# EAGLE design BearJR (EAGLE 6.6.0)
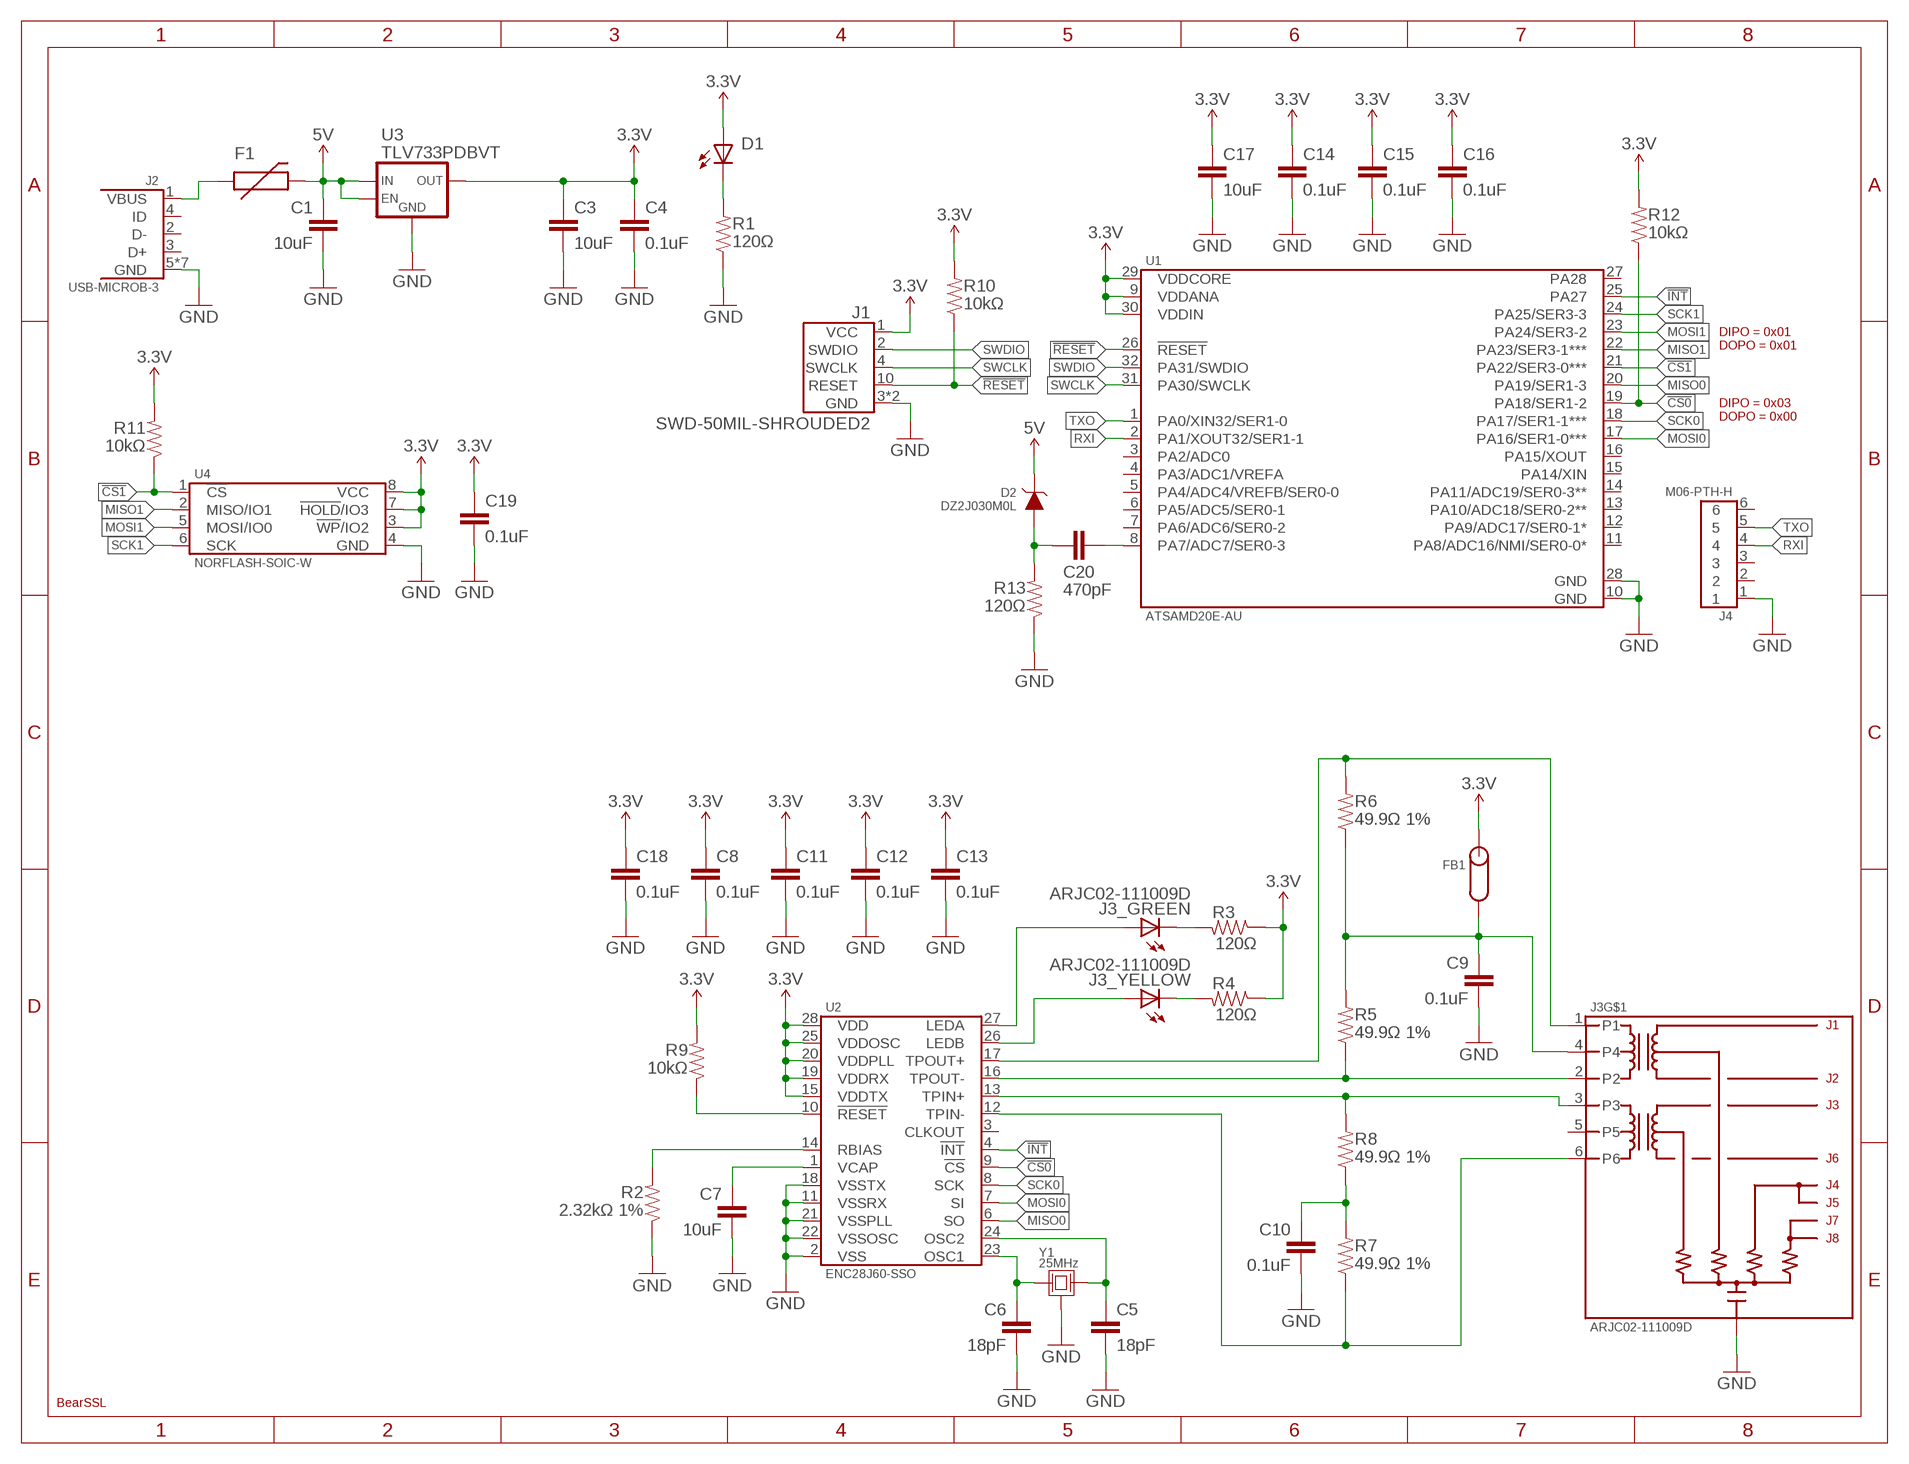
[diagram p0: schematic, sheet 1]

## Parts
C1  10uF  CAP-0603  [0603-CAP]
C3  10uF  CAP-0603  [0603-CAP]
C4  0.1uF  CAP-0603  [0603-CAP]
C5  18pF  CAP-0603  [0603-CAP]
C6  18pF  CAP-0603  [0603-CAP]
C7  10uF  CAP-0603  [0603-CAP]
C8  0.1uF  CAP-0603  [0603-CAP]
C9  0.1uF  CAP-0603  [0603-CAP]
C10  0.1uF  CAP-0603  [0603-CAP]
C11  0.1uF  CAP-0603  [0603-CAP]
C12  0.1uF  CAP-0603  [0603-CAP]
C13  0.1uF  CAP-0603  [0603-CAP]
C14  0.1uF  CAP-0603  [0603-CAP]
C15  0.1uF  CAP-0603  [0603-CAP]
C16  0.1uF  CAP-0603  [0603-CAP]
C17  10uF  CAP-0603  [0603-CAP]
C18  0.1uF  CAP-0603  [0603-CAP]
C19  0.1uF  CAP-0603  [0603-CAP]
C20  470pF  CAP-0603  [0603-CAP]
D1  LED-0603  [0603-LED]
D2  DZ2J030M0L  ZENER-SC90  [SC-90]
F1  PTC-1206  [1206-PTC]
FB1  FERRITE-0805  [0805]
J1  SWD-50MIL-SHROUDED2  [M05X2-50MIL-SHROUD]
J2  USB-MICROB-3  [10118192-0001LF]
J3  ARJC02-111009D  [ETHERNET]
J4  M06-PTH-H  [M06-PTH-H]
R1  120Ω  RESISTOR-0603  [0603-CAP]
R2  2.32kΩ 1%  RESISTOR-0603  [0603-CAP]
R3  120Ω  RESISTOR-0603  [0603-CAP]
R4  120Ω  RESISTOR-0603  [0603-CAP]
R5  49.9Ω 1%  RESISTOR-0805  [0805-RES]
R6  49.9Ω 1%  RESISTOR-0805  [0805-RES]
R7  49.9Ω 1%  RESISTOR-0805  [0805-RES]
R8  49.9Ω 1%  RESISTOR-0805  [0805-RES]
R9  10kΩ  RESISTOR-0603  [0603-CAP]
R10  10kΩ  RESISTOR-0603  [0603-CAP]
R11  10kΩ  RESISTOR-0603  [0603-CAP]
R12  10kΩ  RESISTOR-0603  [0603-CAP]
R13  120Ω  RESISTOR-0603  [0603-CAP]
U1  ATSAMD20E-AU  [TQFP-32]
U2  ENC28J60-SSO  [SSOP-28]
U3  TLV733PDBVT  [SOT-23-5]
U4  NORFLASH-SOIC-W  [SOIC-8-W]
U$1  BEAR_SSL  [BEAR_SSL]
Y1  25MHz  CRYSTAL-3.2X2.5  [FA-238]

## Nets
3.3V: C3.1 C4.1 C8.1 C11.1 C12.1 C13.1 C14.1 C15.1 C16.1 C17.1 C18.1 C19.1 D1.A FB1.2 J1.1(VCC) R3.1 R4.1 R9.2 R10.2 R11.2 R12.2 U1.9(VDDANA) U1.29(VDDCORE) U1.30(VDDIN) U2.15(VDDTX) U2.19(VDDRX) U2.20(VDDPLL) U2.25(VDDOSC) U2.28(VDD) U3.5(OUT) U4.3(!WP!/IO2) U4.7(!HOLD!/IO3) U4.8(VCC)
5V: C1.1 D2.C F1.P$2 U3.1(IN) U3.3(EN)
!CS0: R12.1 U1.19(PA18/SER1-2) U2.9(!CS)
!CS1: R11.1 U1.21(PA22/SER3-0***) U4.1(!CS)
!INT: U1.25(PA27) U2.4(!INT)
!RESET: J1.10(RESET) R10.1 U1.26(!RESET)
CT: C9.1 FB1.1 J3.4 R5.2 R6.1
GND: C1.2 C3.2 C4.2 C5.2 C6.2 C7.2 C8.2 C9.2 C10.2 C11.2 C12.2 C13.2 C14.2 C15.2 C16.2 C17.2 C18.2 C19.2 J1.3(GND) J1.5(GND) J2.5(GND) J2.P$6(GND) J2.P$7(GND) J2.P$8(GND) J2.P$9(GND) J2.P$10(GND) J2.P$11(GND) J3.8 J3.P$5(P8) J3.P$6(P8) J4.1 R1.1 R2.1 R13.1 U1.10(GND) U1.28(GND) U2.2(VSS) U2.11(VSSRX) U2.18(VSSTX) U2.21(VSSPLL) U2.22(VSSOSC) U3.2(GND) U4.4(GND) Y1.2(GND) Y1.4(GND)
MISO0: U1.20(PA19/SER1-3) U2.6(SO)
MISO1: U1.22(PA23/SER3-1***) U4.2(MISO/IO1)
MOSI0: U1.17(PA16/SER1-0***) U2.7(SI)
MOSI1: U1.23(PA24/SER3-2) U4.5(MOSI/IO0)
N$1: F1.P$1 J2.1(VBUS)
N$2: R2.2 U2.14(RBIAS)
N$3: C7.1 U2.1(VCAP)
N$5: D1.C R1.2
N$6: C6.1 U2.23(OSC1) Y1.1
N$7: C5.1 U2.24(OSC2) Y1.3
N$8: R9.1 U2.10(!RESET)
N$9: J3.9(_GREEN:A) U2.27(LEDA)
N$10: J3.11(_YELLOW:A) U2.26(LEDB)
N$11: J3.10(_GREEN:C) R3.2
N$12: J3.12(_YELLOW:C) R4.2
N$13: C20.1 D2.A R13.2
N$14: C20.2 U1.8(PA7/ADC7/SER0-3)
N$17: C10.1 R7.2 R8.1
RXI: J4.4 U1.2(PA1/XOUT32/SER1-1)
SCK0: U1.18(PA17/SER1-1***) U2.8(SCK)
SCK1: U1.24(PA25/SER3-3) U4.6(SCK)
SWCLK: J1.4(SWCLK) U1.31(PA30/SWCLK)
SWDIO: J1.2(SWDIO) U1.32(PA31/SWDIO)
TPIN_N: J3.6 R7.1 U2.12(TPIN-)
TPIN_P: J3.3 R8.2 U2.13(TPIN+)
TPOUT_N: J3.2 R5.1 U2.16(TPOUT-)
TPOUT_P: J3.1 R6.2 U2.17(TPOUT+)
TXO: J4.5 U1.1(PA0/XIN32/SER1-0)
Unconnected: J2.2(D-) J2.3(D+) J2.4(ID) J3.5 J4.2 J4.3 J4.6 U1.3(PA2/ADC0) U1.4(PA3/ADC1/VREFA) U1.5(PA4/ADC4/VREFB/SER0-0) U1.6(PA5/ADC5/SER0-1) U1.7(PA6/ADC6/SER0-2) U1.11(PA8/ADC16/NMI/SER0-0*) U1.12(PA9/ADC17/SER0-1*) U1.13(PA10/ADC18/SER0-2**) U1.14(PA11/ADC19/SER0-3**) U1.15(PA14/XIN) U1.16(PA15/XOUT) U1.27(PA28) U2.3(CLKOUT)

## Notes on the sheet
- DIPO = 0x01
  DOPO = 0x01
- DIPO = 0x03
  DOPO = 0x00

## Library data of the parts
C1 C3-C20 = Passives:CAP
D1 = Passives:LED
D2 = Passives:ZENER
F1 = Passives:PTC
FB1 = Passives:FERRITE
J1 = Connectors:SWD
J2 = Connectors:USB-MICROB
J3 = Connectors:ARJC02-111009D
J4 = Connectors:M06
R1-R13 = Passives:RESISTOR
U1 = Atmel:ATSAMD20E
U2 = Microchip:ENC28J60
U3 = TI:TLV733P
U4 = Passives:NORFLASH
U$1 = Passives:BEAR_SSL
Y1 = Passives:CRYSTAL

## Board
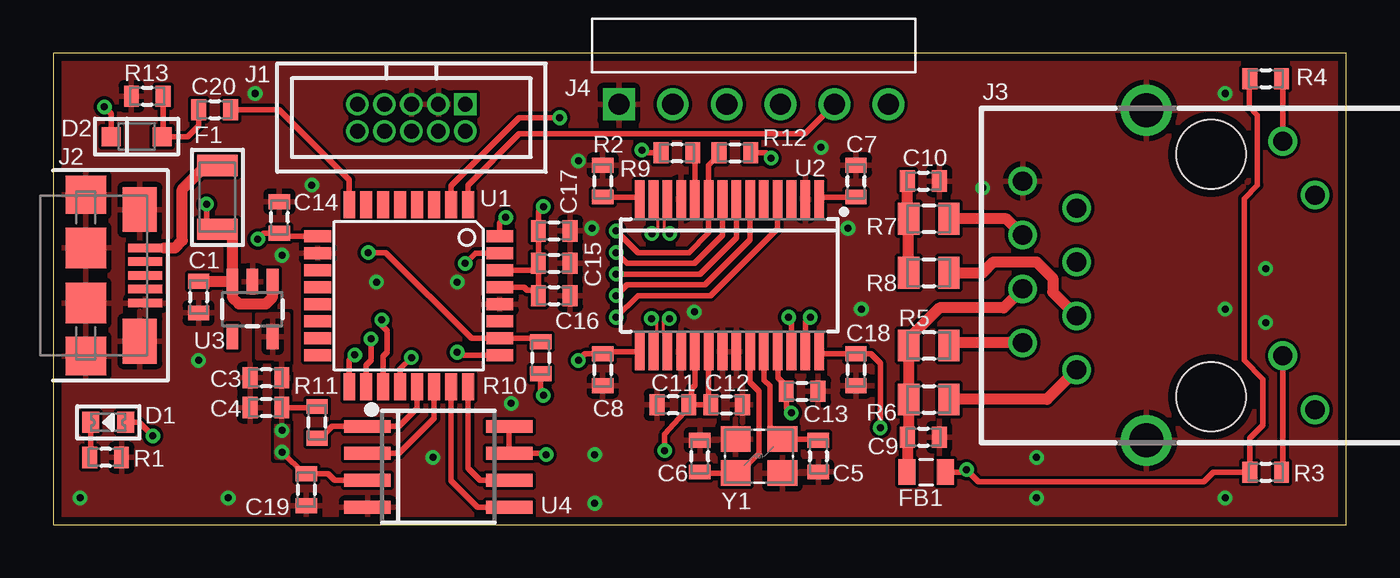
[diagram p1: board, top side]
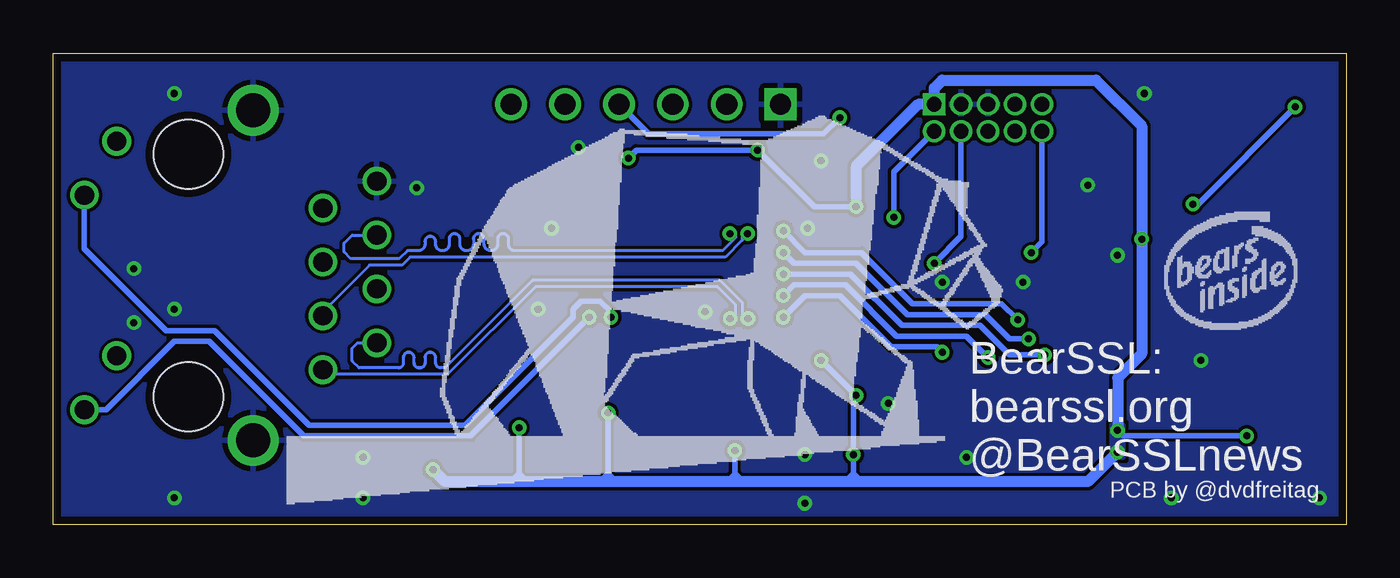
[diagram p2: board, bottom side, seen from below]

Size 60.96 x 22.23 mm. Coordinates in mm from the lower left corner, seen from the top.
Outline: 0,0 60.96,0 60.96,22.23 0,22.23 0,0
Copper layers (1*16): Top 0.0356mm / dielectric 1.5011mm / Bottom 0.0356mm
Design rules "oshpark-2layer *": minimum track width 6mil, minimum drill 13mil, track to track 6mil, track to pad 6mil, pad to pad 6mil, via to via 6mil, smd to smd 6mil, copper to edge 15mil, drill to drill 6mil, minimum pad ring 7mil, minimum via ring 7mil, stop-mask expansion 2.5mil, vias tented up to drill 20mil, thermal gap 10mil

### Footprints (pad centres in the part's own frame; a part is rotated, then mirrored left to right if it is on the bottom)
0603-CAP = smd 0.7 x 1: 1 -0.75,0; 2 0.75,0
0603-LED = smd 0.8 x 1: A 0.825,0; C -0.825,0
SC-90 = smd 0.9 x 0.9: A 1.2,0; C -1.2,0
1206-PTC = smd 1 x 1.9: P$1 1.5,0; P$2 -1.5,0
0805 = smd 0.8 x 1.2: 1 -0.9,0; 2 0.9,0
M05X2-50MIL-SHROUD = drill 0.7 pad 1 square: 1 -2.54,-0.635 | drill 0.7 pad 1: 2 -2.54,0.635; 3 -1.27,-0.635; 4 -1.27,0.635; 5 0,-0.635; 6 0,0.635; 7 1.27,-0.635; 8 1.27,0.635; 9 2.54,-0.635; 10 2.54,0.635
10118192-0001LF = smd 1.6 x 0.4: 1 -0.1,1.3; 2 -0.1,0.65; 3 -0.1,0; 4 -0.1,-0.65; 5 -0.1,-1.3 | smd 1.6 x 2.1: P$6 -0.35,-3.1; P$7 -0.35,3.1 | smd 1.9 x 1.9: P$8 -2.9,1.3; P$9 -2.9,-1.3 | smd 1.9 x 1.8: P$10 -2.9,3.8; P$11 -2.9,-3.8
ETHERNET = drill 0.9: 1 -4.445,6.37; 2 -3.175,8.91; 3 -1.905,6.37; 4 -0.635,8.91; 5 0.635,6.37; 6 1.905,8.91; 7 3.175,6.37; 8 4.445,8.91; 9 -6.325,-4.87; 10 -3.785,-3.35; 11 3.785,-4.87; 12 6.325,-3.35 | drill 1.6: P$5 7.775,3.08; P$6 -7.775,3.08 | hole 3.25: 5.715,0.03; -5.715,0.03
M06-PTH-H = drill 1 square: 1 0,0 | drill 1: 2 2.54,0; 3 5.08,0; 4 7.62,0; 5 10.16,0; 6 12.7,0
0805-RES = smd 1 x 1.5: 1 -0.95,0; 2 0.95,0
TQFP-32 = smd 1.27 x 0.559: 1 -4.293,2.8; 2 -4.293,2; 3 -4.293,1.2; 4 -4.293,0.4; 5 -4.293,-0.4; 6 -4.293,-1.2; 7 -4.293,-2; 8 -4.293,-2.8; 17 4.293,-2.8; 18 4.293,-2; 19 4.293,-1.2; 20 4.293,-0.4; 21 4.293,0.4; 22 4.293,1.2; 23 4.293,2; 24 4.293,2.8 | smd 0.559 x 1.27: 9 -2.8,-4.293; 10 -2,-4.293; 11 -1.2,-4.293; 12 -0.4,-4.293; 13 0.4,-4.293; 14 1.2,-4.293; 15 2,-4.293; 16 2.8,-4.293; 25 2.8,4.293; 26 2,4.293; 27 1.2,4.293; 28 0.4,4.293; 29 -0.4,4.293; 30 -1.2,4.293; 31 -2,4.293; 32 -2.8,4.293
SSOP-28 = smd 1.75 x 0.45: 1 -3.6,4.225; 2 -3.6,3.575; 3 -3.6,2.925; 4 -3.6,2.275; 5 -3.6,1.625; 6 -3.6,0.975; 7 -3.6,0.325; 8 -3.6,-0.325; 9 -3.6,-0.975; 10 -3.6,-1.625; 11 -3.6,-2.275; 12 -3.6,-2.925; 13 -3.6,-3.575; 14 -3.6,-4.225; 15 3.6,-4.225; 16 3.6,-3.575; 17 3.6,-2.925; 18 3.6,-2.275; 19 3.6,-1.625; 20 3.6,-0.975; 21 3.6,-0.325; 22 3.6,0.325; 23 3.6,0.975; 24 3.6,1.625; 25 3.6,2.275; 26 3.6,2.925; 27 3.6,3.575; 28 3.6,4.225
SOT-23-5 = smd 1.2 x 0.55: 1 -1.3,0.95; 2 -1.3,0; 3 -1.3,-0.95; 4 1.3,-0.95; 5 1.3,0.95
SOIC-8-W = smd 2.2 x 0.6: 1 -3.34,1.905; 2 -3.34,0.635; 3 -3.34,-0.635; 4 -3.34,-1.905; 5 3.34,-1.905; 6 3.34,-0.635; 7 3.34,0.635; 8 3.34,1.905
FA-238 = smd 1.4 x 1.2: 1 -1.1,-0.8; 2 1.1,-0.8; 3 1.1,0.8; 4 -1.1,0.8

### Placement (x,y rotation side)
C1  6.86,10.73 270 top
C3  10.03,6.92 180 top
C4  10.03,5.52 180 top
C5  36.07,3.24 270 top
C6  30.48,3.24 90 top
C7  37.85,16.19 90 top
C8  25.91,7.3 270 top
C9  41.02,4.13 0 top
C10  41.02,16.19 0 top
C11  29.21,5.65 180 top
C12  31.75,5.65 0 top
C13  35.31,6.29 0 top
C14  10.67,14.48 90 top
C15  23.62,12.32 0 top
C16  23.62,10.79 0 top
C17  23.62,13.84 0 top
C18  37.85,7.3 270 top
C19  11.94,1.65 270 top
C20  7.62,19.56 0 top
D1  2.6,4.83 0 top
D2  3.94,18.29 0 top
F1  7.75,15.43 90 top
FB1  41.15,2.48 0 top
J1  16.89,19.18 180 top
J2  4.45,11.75 0 top
J3  54.61,11.75 90 top
J4  26.67,19.81 0 top
R1  2.48,3.17 180 top
R2  25.91,16.19 270 top
R3  57.15,2.48 0 top
R4  57.15,21.02 0 top
R5  41.27,8.45 180 top
R6  41.27,5.91 0 top
R7  41.27,14.41 180 top
R8  41.27,11.87 0 top
R9  29.4,17.53 180 top
R10  22.99,7.87 270 top
R11  12.45,4.83 90 top
R12  32.13,17.53 0 top
R13  4.45,20.19 0 top
U1  16.76,10.79 270 top
U2  31.88,11.75 270 top
U3  9.4,10.16 270 top
U4  18.16,2.73 0 top
U$1  49.91,1.02 0 bottom
Y1  33.27,3.24 0 top

### Tracks (layer width: path | path; a pad name or v marks a point on that pad's centre or on a via)
3.3V  (via drill 0.33)
  Top 0.254: v34.8,5.27 34.56,5.51 C13.1 34.56,6.53 34.16,6.92 34.16,8.14 U2.25 | U2.28 36.2,8.05 C18.1 38.56,8.05 38.99,7.62 v38.99,4.57 | U2.20 30.9,5.75 C12.1 C11.1 | C11.1 30.1,5.79 30.1,6.41 30.25,6.57 U2.19 | U2.15 26,8.15 C8.1 25.07,8.05 v24.77,7.75 | FB1.2 42.93,2.48 v43.05,2.6 43.62,2.03 54.23,2.03 54.67,2.48 R3.1 56.4,4.08 57.02,4.7 57.02,6.86 56.13,7.75 56.13,15.37 56.77,16 56.77,19.3 56.39,19.68 56.39,21.01 R4.1 | U1.29 22.21,11.2 22.35,11.05 22.62,11.05 C16.1 C15.1 | U1.30 22.66,11.99 22.73,12.06 22.75,12.06 C15.1 | C15.1 C17.1 22.87,14.74 v23.11,14.99 | R10.2 22.99,6.22 v23.11,6.1 | U1.9 10.8,13.6 C14.1 9.92,13.73 v9.65,13.46 | v28.83,3.49 28.83,4.25 29.96,5.51 C11.1 | D1.A 4.06,4.83 v4.7,4.19 | R9.2 27.88,17.53 v27.75,17.65 | U4.8 U4.7 23.18,3.37 v23.24,3.3 | U4.3 13.27,2.1 12.97,2.4 C19.1 11.82,2.4 v10.79,3.43 | R11.2 12.39,5.52 C4.1 | R12.2 33.59,17.53 v33.85,17.27
  Bottom 0.254: v4.7,4.19 10.54,4.19 v10.79,4.45 | v38.99,4.57 38.99,2.41 | 38.99,2.41 38.99,2.03 | 38.99,2.41 38.61,2.03 | 38.99,2.41 39.37,2.03 | 34.8,2.03 34.8,2.41 | 34.8,2.41 v34.8,5.27 | 34.8,2.41 35.18,2.03 | 34.8,2.41 34.42,2.03 | 28.83,2.03 28.83,2.41 | 28.83,2.41 v28.83,3.49 | 28.83,2.41 29.21,2.03 | 28.83,2.41 28.45,2.03 | v23.11,14.99 25.08,14.99 v27.75,17.65 33.47,17.65 v33.85,17.27 | 23.24,2.41 v23.24,3.3 23.24,5.97 v23.11,6.1 v24.77,7.75 | 23.24,2.41 23.24,2.03 | 23.24,2.41 22.86,2.03 | 23.24,2.41 23.62,2.03
  Bottom 0.508: v23.11,14.99 23.11,16.89 20.19,19.81 J1.1 19.43,20.57 19.05,20.95 11.81,20.95 9.65,18.8 v9.65,13.46 9.65,8.05 C3.1 v10.78,4.46 v10.79,4.45 | v10.79,3.43 12.19,2.03 22.86,2.03 23.24,2.03 23.62,2.03 28.45,2.03 28.83,2.03 29.21,2.03 34.42,2.03 34.8,2.03 35.18,2.03 38.61,2.03 38.99,2.03 39.37,2.03 42.48,2.03 v43.05,2.6
  pour Top: 9.65,9.91 11.05,9.91 11.05,3.17 10.54,3.17 10.54,7.87 9.65,7.87
  pour Bottom: 10.54,3.17 11.05,3.17 11.05,4.7 10.54,4.7
5V  (via drill 0.33)
  Top 0.254: D2.C 2.74,19.36 v2.41,19.68 | F1.P$2 7.24,13.93 v7.24,15.11
  Top 0.508: C1.1 8.43,11.48 U3.3 | F1.P$2 8.45,13.93 U3.3 | U3.3 8.45,10.73 8.76,10.41 10.03,10.41 10.35,10.73 U3.1
  Bottom 0.254: v7.24,15.11 6.99,15.11 v2.41,19.68
!CS0  (via drill 0.33)
  Top 0.254: v26.54,13.84 27.56,12.83 29.97,12.83 30.9,13.76 U2.9 30.9,16.93 31.38,17.41 R12.1 | v15.49,9.65 15.49,9.4 15.75,9.14 15.75,8.13 15.56,7.94 U1.19
  Bottom 0.254: v26.54,13.84 25.53,12.83 22.86,12.83 20.45,10.41 16.26,10.41 v15.49,9.65
!CS1
  Top 0.254: R11.1 12.59,4.08 13.14,4.64 U4.1 16.32,4.64 17.16,5.48 U1.21
!INT  (via drill 0.33)
  Top 0.254: U2.4 34.15,13.96 30.99,10.79 27.56,10.79 v26.54,9.78 | U1.25 19.18,8 v19.05,8.13
  Bottom 0.254: v26.54,9.78 25.53,10.79 23.88,10.79 21.46,8.38 19.3,8.38 v19.05,8.13
!RESET  (via drill 0.33)
  Top 0.254: R10.1 22.82,8.79 U1.26 19.72,8.79 15.69,12.83 v14.86,12.83
  Bottom 0.254: J1.10 14.35,13.34 v14.86,12.83
CT
  Top 0.508: J3.4 44.81,10.22 41.78,10.22 40.51,8.95 40.51,8.63 R5.2 R6.1 40.33,4.18 C9.1 40.27,2.5 FB1.1
GND  (via drill 0.33)
  other vias: 1.27,1.27 8.26,1.27 12.19,16 6.86,7.75 10.79,12.7 15.24,11.43 19.05,11.43 21.59,5.71 30.23,10.03 46.35,3.17 46.35,1.27 55.24,1.27 57.15,9.53 57.15,12.06 55.24,10.16 55.24,20.32 43.81,15.88 37.47,13.97 36.2,17.78 24.77,17.14 25.4,13.97 9.53,20.32 38.1,10.16 17.91,3.17 25.53,1.02 25.53,3.3
  pour Top (rank 2): -0.64,-0.64 -0.64,22.86 61.59,22.86 61.59,-0.64
  pour Bottom (rank 2): -1.27,-1.27 -1.27,23.5 62.23,23.5 62.23,-1.27
MISO0  (via drill 0.33)
  Top 0.254: U2.6 32.85,13.42 30.73,11.3 27.05,11.3 v26.54,10.79 | U1.20 16.36,7.35 v16.89,7.87
  Bottom 0.254: v26.54,10.79 26.04,11.3 23.62,11.3 21.21,8.89 17.91,8.89 v16.89,7.87
MISO1
  Top 0.254: U1.22 17.96,5.01 16.32,3.37 U4.2
MOSI0  (via drill 0.33)
  Top 0.254: U2.7 32.2,13.53 30.48,11.81 v26.54,11.81 | v14.22,8 13.96,7.74 U1.17
  Bottom 0.254: v26.54,11.81 23.37,11.81 20.95,9.4 17.27,9.4 15.88,8 v14.22,8
MOSI1
  Top 0.254: U1.23 18.76,2.06 20,0.83 U4.5
N$1
  Top 0.254: J2.1 5.24,13.05
  Top 0.508: 5.24,13.05 5.75,13.05 6.1,13.4 6.1,15.81 7.21,16.93 F1.P$1
N$2
  Top 0.254: U2.14 27.56,15.44 R2.2
N$3
  Top 0.254: U2.1 36.2,15.44 C7.1
N$5
  Top 0.254: R1.2 1.78,3.23 D1.C
N$6
  Top 0.254: U2.23 32.85,6.71 33.27,6.29 33.27,3.37 32.35,2.44 Y1.1 30.53,2.44 C6.1
N$7
  Top 0.254: U2.24 33.5,6.82 33.78,6.54 33.78,4.63 Y1.3 36.02,4.04 C5.1
N$8
  Top 0.254: U2.10 30.25,17.42 R9.1
N$9  (via drill 0.33)
  Top 0.254: U2.27 35.45,9.54 v35.69,9.78
  Bottom 0.254: v35.69,9.78 41.27,4.19 49.15,4.19 53.59,8.64 55.24,8.64 58.46,5.42 J3.9
N$10  (via drill 0.33)
  Top 0.254: U2.26 34.8,9.65 v34.67,9.78
  Bottom 0.254: v34.67,9.78 34.67,10.03 35.18,10.54 36.07,10.54 36.45,10.16 36.45,9.78 41.53,4.7 48.9,4.7 53.34,9.14 55.63,9.14 59.48,13 J3.11
N$11
  Top 0.254: J3.10 57.96,2.54 R3.2
N$12
  Top 0.254: J3.12 57.96,20.96 R4.2
N$13
  Top 0.254: R13.2 5.2,18.35 D2.A 6.35,18.29 6.87,18.81 C20.1
N$14
  Top 0.254: U1.8 13.96,16.26 10.67,19.56 C20.2
N$17
  Top 0.508: R8.1 R7.2 40.27,14.47 C10.1
RXI  (via drill 0.33)
  Top 0.254: v23.88,19.18 21.97,19.18 18.76,15.97 U1.2
  Bottom 0.254: J4.4 32.89,18.41 24.64,18.41 v23.88,19.18
SCK0  (via drill 0.33)
  Top 0.254: U2.8 31.55,13.64 30.23,12.32 27.05,12.32 v26.54,12.83 | v14.99,8.76 14.99,7.75 14.76,7.53 U1.18
  Bottom 0.254: v26.54,12.83 26.04,12.32 23.11,12.32 20.7,9.91 17.02,9.91 15.88,8.76 v14.99,8.76
SCK1
  Top 0.254: U1.24 19.56,2.66 20.13,2.1 U4.6
SWCLK  (via drill 0.33)
  Top 0.254: U1.31 19.91,12.79 v19.43,12.32
  Bottom 0.254: v19.43,12.32 18.16,13.59 J1.4
SWDIO  (via drill 0.33)
  Top 0.254: U1.32 21.06,14.2 v21.34,14.48
  Bottom 0.254: v21.34,14.48 21.34,16.64 J1.2
TPIN_N  (via drill 0.33)
  Top 0.152: U2.12 28.95,14.64 28.79,14.48 28.79,13.72 v29.06,13.72
  Top 0.508: J3.6 44.94,14.41 R7.1
  Bottom 0.152: v29.06,13.72 28.79,13.72 28.79,13.53 29.4,12.92 39.2,12.92 arc90 39.5,13.21 39.5,13.46 arc-90 39.75,13.72 arc-90 40.01,13.46 40.01,13.21 arc90 40.3,12.92 40.35,12.92 arc90 40.64,13.21 40.64,13.46 arc-90 40.89,13.72 arc-90 41.15,13.46 41.15,13.21 arc90 41.44,12.92 41.49,12.92 arc90 41.78,13.21 41.78,13.46 arc-90 42.04,13.72 arc-90 42.29,13.46 42.29,13.21 arc90 42.58,12.92 42.63,12.92 arc90 42.93,13.21 42.93,13.34 arc-90 43.18,13.59 arc-90 43.43,13.34 43.43,13.21 arc90 43.73,12.92 44.26,12.92 44.64,12.54 46.93,12.54 47.24,12.85 47.24,13.27 46.86,13.65 J3.6
TPIN_P  (via drill 0.33)
  Top 0.152: U2.13 28.3,14.66 28.49,14.48 28.49,13.72 v28.22,13.72
  Top 0.508: R8.2 43.81,11.87 44.32,12.38 46.35,12.38 47.12,11.62 47.12,10.97 J3.3
  Bottom 0.152: v28.22,13.72 28.49,13.72 28.49,13.4 29.27,12.61 44.13,12.61 44.51,12.23 46.04,12.23 48.24,10.03 J3.3
TPOUT_N  (via drill 0.33)
  Top 0.152: U2.16 28.3,8.85 28.47,9.02 28.47,9.72 v28.21,9.72
  Top 0.508: J3.2 42.35,8.57 R5.1
  Bottom 0.152: v28.21,9.72 28.47,9.72 28.47,10.46 29.53,11.52 38.35,11.52 42.48,7.39 42.7,7.39 arc90 42.93,7.62 42.93,7.87 arc-90 43.18,8.13 arc-90 43.43,7.87 43.43,7.62 arc90 43.66,7.39 43.71,7.39 arc90 43.94,7.62 43.94,7.87 arc-90 44.2,8.13 arc-90 44.45,7.87 44.45,7.62 arc90 44.68,7.39 46.55,7.39 46.86,7.71 46.86,8.32 46.61,8.57 J3.2
TPOUT_P  (via drill 0.33)
  Top 0.152: U2.17 28.95,8.84 28.78,9.02 28.78,9.72 v29.05,9.72
  Top 0.508: J3.1 46.84,5.91 R6.2
  Bottom 0.152: v29.05,9.72 28.78,9.72 28.78,10.34 29.65,11.21 38.23,11.21 42.35,7.09 48.02,7.09 J3.1
TXO
  Top 0.254: U1.1 19.56,16.01 21.97,18.41 35.43,18.41 J4.5

### Text on the board
bPlace: BearSSL: / bearssl.org / @BearSSLnews | PCB by @dvdfreitag